# EAGLE design Puzzle Infrared Temperature Sensor V1.0 (EAGLE 6.2)
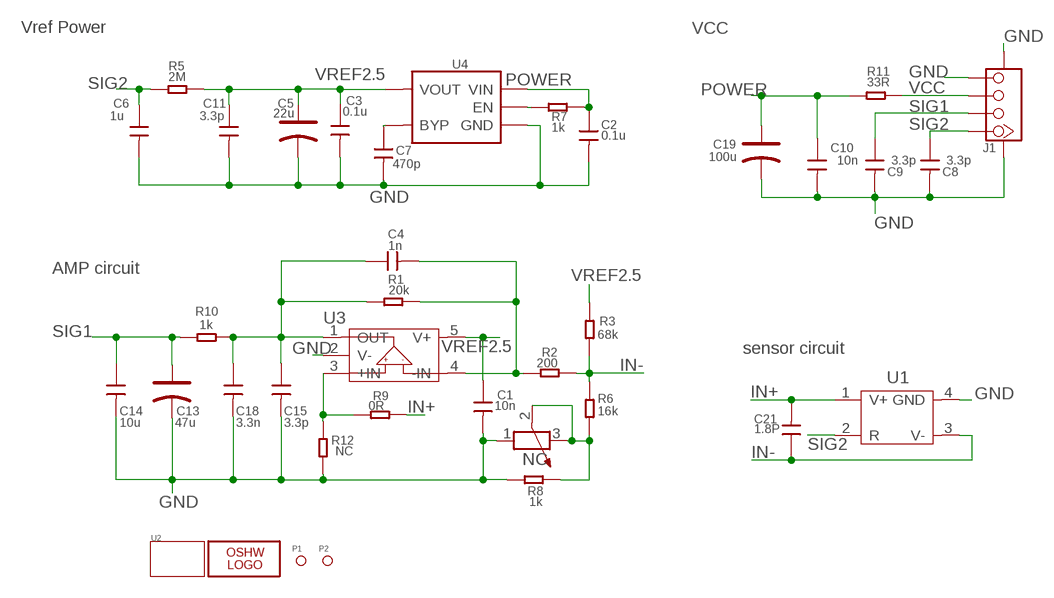
[diagram p0: schematic, sheet 1]

## Parts
C1  10n  C-0603  [0603]
C2  0.1u  C-0402  [0402]
C3  0.1u  C-0402  [0402]
C4  1n  C-0603  [0603]
C5  22u  CAP-AVX-A  [AVX-A]
C6  1u  C-0603  [0603]
C7  470p  C-0402  [0402]
C8  3.3p  C-0402  [0402]
C9  3.3p  C-0402  [0402]
C10  10n  C-0402  [0402]
C11  3.3p  C-0402  [0402]
C13  47u  CAP-AVX-A  [AVX-A]
C14  10u  C-0603  [0603]
C15  3.3p  C-0603  [0603]
C18  3.3n  C-0603  [0603]
C19  100u  CAP-AVX-B  [AVX-B]
C21  1.8P  C-0603  [0603]
J1  TWIG-4P-2.0-SMD-FEMALE-REINFORCE'90D'  [4P-SMD-2.0-90D]
LOGO1  LOGO-OSHW-6MILX0200-NT  [OSHW_6X200_NOTEXT]
P1  PAD-MARK  [ROUND-MARK-0.635]
P2  PAD-MARK  [ROUND-MARK-0.635]
R1  20k  R-0603  [0603]
R2  200  R-0603  [0603]
R3  68k  R-0603  [0603]
R4  NC  R-POTENTIOMETER-SMD  [3P-SMD-SQUA-3.6X3.3]
R5  2M  R-0402  [0402]
R6  16k  R-0603  [0603]
R7  1k  R-0402  [0402]
R8  1k  R-0603  [0603]
R9  0R  R-0603  [0603]
R10  1k  R-0603  [0603]
R11  33R  R-0402  [0402]
R12  NC  R-0603  [0603]
U1  SENSOR-OTP-538U  [4P-5.4MM]
U2  TWIG-2U  [2U-DIM-W/-DRILL]
U3  OPA333  [SOT23-5]
U4  MIC5205  [SOT23-5]

## Nets
GND: C1.2 C2.2 C3.2 C5.- C6.2 C7.2 C8.2 C9.2 C10.2 C11.2 C13.- C14.2 C15.2 C18.2 C19.- J1.4 J1.SS1 J1.SS2 R4.1 R8.1 R12.1 U1.4(GND) U3.2(V-) U4.2(GND)
IN+: C21.2 R9.1 U1.1(V+)
IN-: C21.1 R2.1 R3.2 R6.1 U1.3(V-)
N$1: C4.2 R1.1 R2.2 U3.4(-IN)
N$2: R4.2 R4.3 R6.2 R8.2
N$3: R7.1 U4.3(EN)
N$4: R9.2 R12.2 U3.3(+IN)
N$5: C7.1 U4.4(BYP)
N$10: C4.1 C15.1 C18.1 R1.2 R10.1 U3.1(OUT)
POWER: C2.1 C10.1 C19.+ R7.2 R11.1 U4.1(VIN)
SIG1: C9.1 C13.+ C14.1 J1.2 R10.2
SIG2: C6.1 C8.1 J1.1 R5.1 U1.2(R)
VCC: J1.3 R11.2
VREF2.5: C1.1 C3.1 C5.+ C11.1 R3.1 R5.2 U3.5(V+) U4.5(VOUT)

## Notes on the sheet
- Vref Power | VCC
- AMP circuit
- sensor circuit

## Library data of the parts
C1-C4 C6-C11 C14 C15 C18 C21 = Discrete:C*: Ceramic Capacitors
C5 C13 C19 = Discrete:CAP*: Electrolytic Capacitors,Tantalum Capacitors and Super Capacitors
J1 = Connector:TWIG-4P-2.0-SMD-FEMALE-REINFORCE
LOGO1 = Logo:LOGO-OSHW-6MIL
P1 P2 = Discrete:PAD-MARK
R1-R3 R5-R12 = Discrete:R*
R4 = Discrete:R-POTENTIOMETER*: Potentiometer
U1 = Discrete:SENSOR-OTP-538U
U2 = Module:TWIG
U3 = IC:OPA333
U4 = IC:MIC5205: The MIC5205 is an efficient linear voltage regulator with ultra-low-noise output, very low dropout voltage (typically 17mV at light loads and 165mV at 150mA), and very low ground current (600µA at 100mA output). The MIC5205 offers better than 1% initial accuracy. datasheet here: http://www.micrel.com/product-info/prod/5205.shtml

## Board
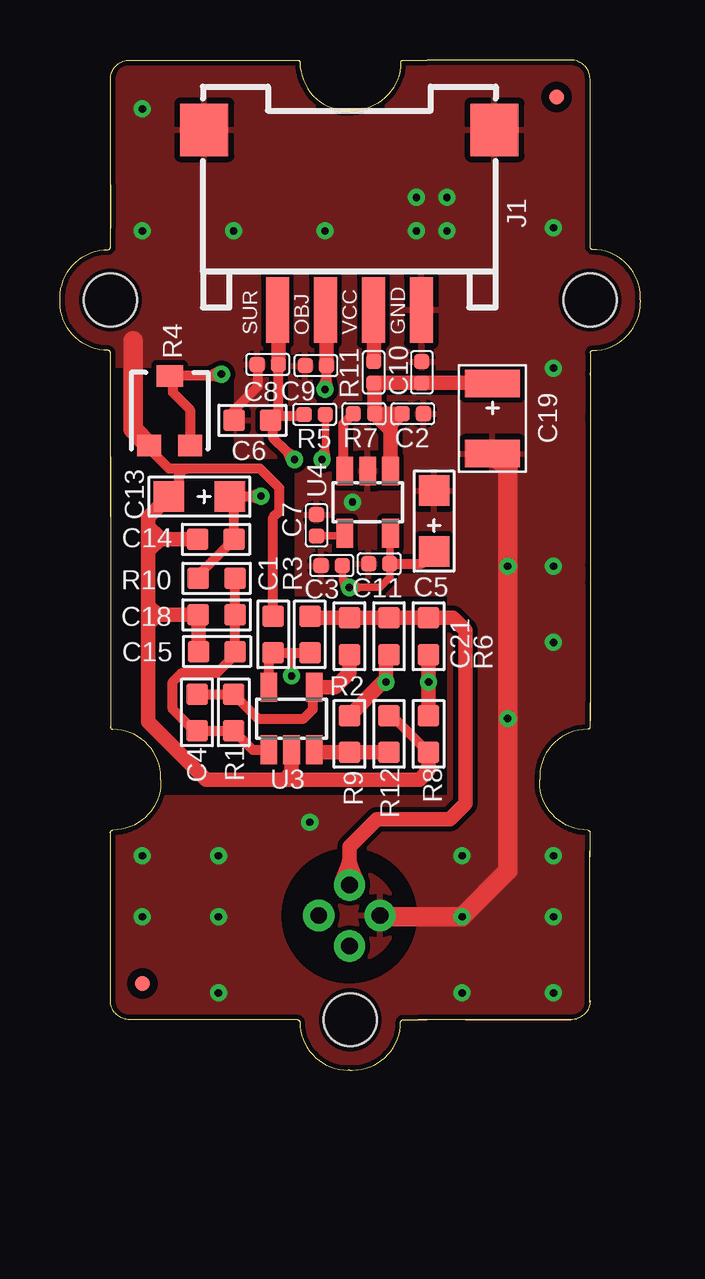
[diagram p1: board, top side]
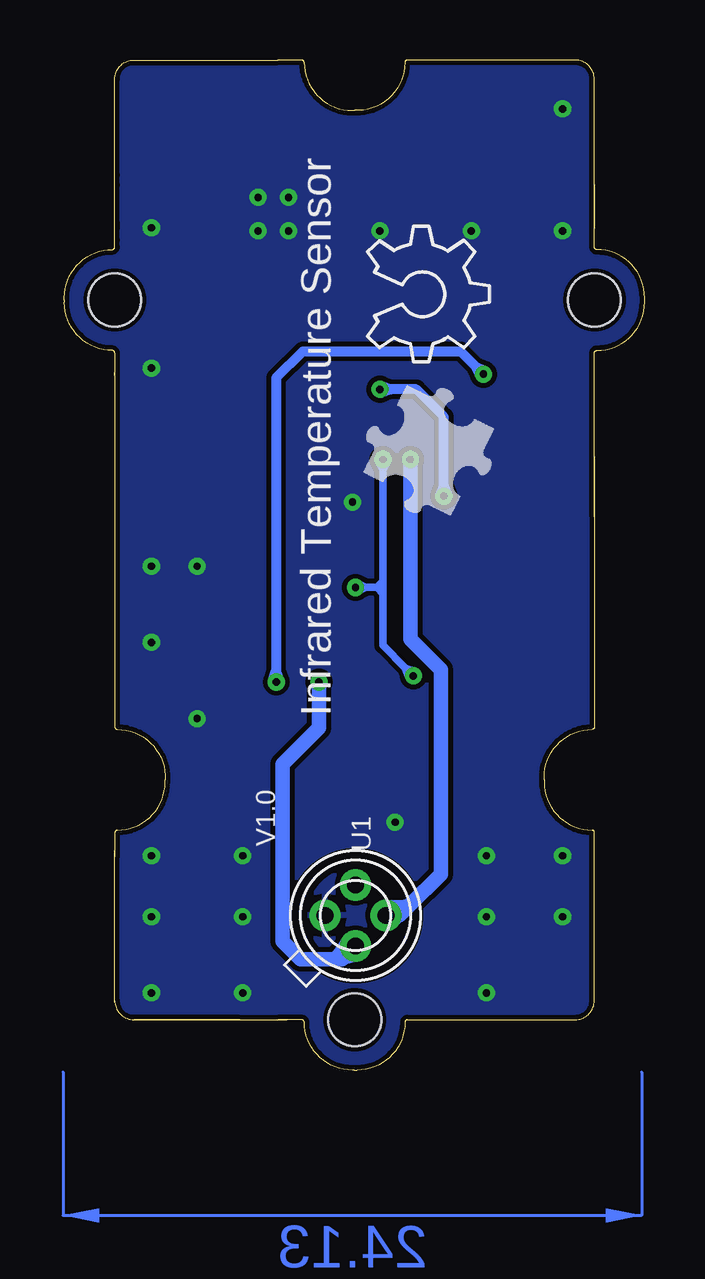
[diagram p2: board, bottom side, seen from below]

Size 24.2 x 42.09 mm. Coordinates in mm from the lower left corner, seen from the top.
Copper layers (1*16): Top 0.035mm / dielectric 1.5mm / Bottom 0.035mm
Design rules "default": minimum track width 6mil, minimum drill 12mil, track to track 8mil, track to pad 8mil, pad to pad 8mil, via to via 8mil, smd to smd 8mil, copper to edge 8mil, drill to drill 8mil, minimum pad ring 10mil, minimum via ring 8mil, stop-mask expansion 4mil, vias tented up to drill 25mil, thermal gap 10mil
tRestrict: area 9.6,4 to 14.5,8.8; area 2.2,11.5 to 16.1,19.7; area 2.2,19.7 to 9.8,25.4; area 2.2,25.4 to 7.2,29.3
bRestrict: area 9.6,4 to 14.5,8.8

### Footprints (pad centres in the part's own frame; a part is rotated, then mirrored left to right if it is on the bottom)
0603 = smd 0.889 x 0.889: 1 -0.762,0; 2 0.762,0
0402 = smd 0.635 x 0.635: 1 -0.445,0; 2 0.445,0
AVX-A = smd 1.27 x 1.27: + -1.27,0; - 1.27,0
AVX-B = smd 1.143 x 2.286: + -1.46,0; - 1.46,0
4P-SMD-2.0-90D = smd 0.965 x 2.74: 1 -3,-0.1; 2 -1,-0.1; 3 1,-0.1; 4 3,-0.1 | smd 2 x 2.184: SS1 -6.05,7.4; SS2 6.05,7.4
ROUND-MARK-0.635 = smd 0.635 x 0.635: P$1 0,0
3P-SMD-SQUA-3.6X3.3 = smd 1 x 0.9: 1 -0.85,-1.45; 3 0.85,-1.45 | smd 1.1 x 0.9: 2 0,1.45
4P-5.4MM = drill 0.7 pad 1.3: 1 0.9,-0.9; 2 0.9,0.9; 3 -0.9,0.9; 4 -0.9,-0.9
2U-DIM-W/-DRILL = hole 2.2: 10.453,-10.42; 10.453,9.58; -19.535,-0.415
SOT23-5 = smd 0.69 x 1.2: 1 -0.95,-1.3; 2 0,-1.3; 3 0.95,-1.3; 4 0.95,1.3; 5 -0.95,1.3

### Placement (x,y rotation side)
C1  8.89,18.16 90 top
C2  14.7,27.35 0 top
C3  11.32,21.03 180 top
C4  5.71,14.9 90 top
C5  15.59,22.88 90 top
C6  8.02,27.07 180 top
C7  10.69,22.7 90 top
C8  8.66,29.41 180 top
C9  10.66,29.36 180 top
C10  15.08,29.08 90 top
C11  13.31,21.1 180 top
C13  5.81,23.9 180 top
C14  6.5,22.12 180 top
C15  6.54,17.44 180 top
C18  6.52,18.97 180 top
C19  18.03,27.15 270 top
C21  13.71,18.08 270 top
J1  12.06,31.78 0 top
LOGO1  11.55,35.17 270 bottom
P1  3.43,3.6 90 top
P2  20.7,40.56 90 top
R1  7.24,14.9 270 top
R2  12.06,18.08 270 top
R3  10.41,18.16 90 top
R4  4.57,27.48 0 top
R5  10.61,27.32 0 top
R6  15.36,18.08 270 top
R7  12.67,27.35 0 top
R8  15.36,14.02 90 top
R9  12.06,14.02 270 top
R10  6.52,20.49 180 top
R11  13.08,29.08 90 top
R12  13.71,14.02 270 top
U1  12.06,6.45 315 bottom
U2  11.68,21.64 90 top
U3  9.65,14.65 0 top
U4  12.82,23.67 180 top
U$1  [BRICK-LOGO-2-B-MIL-0.6]  12.06,22.78 90 top

### Tracks (layer width: path | path; a pad name or v marks a point on that pad's centre or on a via)
GND  (via drill 0.3 pad 0.64)
  Top 0.305: 9.14,12.11 9.65,12.62
  Top 0.406: R12.1 13.84,14.78 R8.1 | C1.2 8.89,23.03 9.14,23.29 9.14,24.25 8.33,25.06 5.33,25.06 | 4.82,24.18 C13.- 4.95,24.3 4.95,24.68 | R4.1 3.72,25.89 4.54,25.06 4.95,25.06 | 5.33,25.06 4.95,25.06 | 4.95,25.06 4.95,24.68 | 5.33,25.06 arc90 4.95,24.68 | C6.2 7.26,27.5 8.25,28.49 8.25,29.37 C8.2
  Top 0.61: 9.65,12.36 9.65,12.24 9.78,12.11 | U3.2 9.65,12.62 9.65,12.36 | 3.68,22.27 3.68,23.03 C13.- | 3.68,22.27 3.68,19.35 | 3.68,19.35 3.68,19.09 | 3.68,19.09 3.68,18.59 | 3.68,18.59 3.68,14.52 6.09,12.11 9.14,12.11 9.78,12.11 | 3.91,22.12 C14.2 | 3.68,22.27 3.83,22.12 3.91,22.12 | 3.68,19.09 3.81,18.97 4.06,18.97 | 5.78,18.95 C15.2 | 9.78,12.11 9.9,12.11 | 9.9,12.11 14.98,12.11 15.36,12.49 R8.1 | 4.06,18.97 3.68,18.59 | 4.06,18.97 C18.2 | 3.68,19.35 4.06,18.97 | 4.06,22.27 4.12,22.21 4.12,22.08 3.74,21.7 | 4.06,22.27 3.74,22.59 | 3.91,22.12 4.06,22.27 | 9.65,12.36 9.9,12.11 | 4.82,24.18 4.57,24.18 4.44,24.05
  Top 0.813: C18.2 5.78,18.95 | C19.- 18.66,25.05 18.66,8.3 v16.76,6.4 13.38,6.4 U1.4 | 3.04,30.4 3.04,26.7 R4.1
  other vias: 12.19,23.67 20.57,17.82 18.66,14.65 20.57,29.25 20.57,35.1 3.43,34.97 7.24,34.97 14.86,34.97 11.04,34.97 3.43,40.05 18.66,21 20.57,21 3.43,6.4 3.43,8.94 6.6,8.94 6.6,6.4 6.6,3.22 20.57,3.22 20.57,6.4 20.57,8.94 16.76,8.94 16.76,3.22 16.12,34.97 16.12,36.37 14.86,36.37 10.41,10.33
  pour Top: 25.02,-0.59 -0.38,-0.59 -0.38,42.59 25.02,42.59
  pour Bottom: 24.25,-0.08 0.12,-0.08 0.12,42.08 24.25,42.08
IN+  (via drill 0.3 pad 0.64)
  Top 0.61: 12.06,14.9 R9.1 13.46,16.17 v13.59,16.17 13.59,17.19 C21.2
  Bottom 0.61: U1.1 12.62,4.62 12.74,4.62 | 12.95,4.62 14.35,4.62 15.11,5.38 15.11,12.75 13.59,14.27 v13.59,16.17 | 12.95,4.62 | 12.95,4.62 12.74,4.62 | 12.95,4.62 12,5.01 | U1.1 12,5.01 | 12.95,4.62 12.82,4.74 | 12.82,4.74 12.18,5.3 | U1.1 12.18,5.3 | 12.95,4.62 12.82,4.74 | 12.82,4.74 12.18,5.3 | U1.1 12.18,5.3 | 12.95,4.62 12,5.01 | 12,5.01 U1.1 | 12.74,4.62 12.37,5.33 U1.1 | 12.74,4.62 11.96,4.84 U1.1 | 12.82,4.74 12.34,5.38 | U1.1 12.34,5.38 | 12.82,4.74 12.02,4.83 | 12.82,4.74 12.34,5.38 | U1.1 12.34,5.38 | 12.02,4.83 12.82,4.74 | U1.1 12.02,4.83 | U1.1 12.35,5.36 12.79,4.69 12,4.83 U1.1
IN-
  Top 0.61: R3.2 10.49,18.84 R2.1 C21.1 R6.1 16.38,18.84 16.9,18.32 16.9,11.1 16.26,10.46 13.2,10.46 12.06,9.32 12.06,8.77 | 12.06,8.77 12.06,8.59 | 12.06,8.59 U1.3 | 12.09,8.59 12.23,7.75 | 12.23,7.75 U1.3 | 12.06,8.77 11.89,7.75 | 11.89,7.75 U1.3 | 12.06,8.77 11.89,7.75 | 11.89,7.75 U1.3 | 12.09,8.59 12.23,7.75 | 12.23,7.75 U1.3 | 12.06,8.77 11.89,7.75 | 12.06,8.77 12.09,8.59 | 12.09,8.59 12.23,7.75 | 12.03,8.59 12.06,8.77 | 11.89,7.75 12.03,8.59 | 11.89,7.75 U1.3 | 12.06,8.77 12.09,8.59 | 12.23,7.75 12.09,8.59 | 12.23,7.75 U1.3 | 12.06,8.59 11.74,7.86 U1.3 | 12.06,8.59 12.38,7.86 U1.3 | 11.74,7.84 | 12.03,8.59 11.74,7.84 | U1.3 11.74,7.84 | 12.03,8.59 12.37,7.87 | 12.37,7.87 | U1.3 12.37,7.87 | 12.09,8.59 11.75,7.87 | 12.09,8.59 12.38,7.84 | 11.74,7.84 12.03,8.59 | U1.3 11.74,7.84 | 12.37,7.87 12.03,8.59 | U1.3 12.37,7.87 | 11.75,7.87 12.09,8.59 | 11.75,7.87 U1.3 | 12.38,7.84 12.09,8.59 | 12.38,7.84 U1.3
N$1
  Top 0.406: C4.2 R1.1 8.25,14.65 10.16,14.65 10.54,15.03 10.54,15.89 U3.4
  Top 0.61: U3.4 11.46,15.95 12.06,16.55 R2.2
N$2  (via drill 0.3 pad 0.64)
  Top 0.406: 6.28,28.93 R4.2 4.7,28.8 4.7,28.24 5.42,27.52 R4.3 | 6.28,28.93 6.65,28.93 v6.73,29 | 6.28,28.93 6.7,28.85 v6.73,29 | 6.28,28.93 6.65,29.13 v6.73,29
  Top 0.61: R8.2 v15.36,16.17 R6.2
  Bottom 0.406: 15.36,16.63 v15.36,16.17 | 7.05,29.32 v6.73,29 | 7.05,29.32 7.68,29.95 14.26,29.95 15.36,28.84 15.36,16.63 | 15.36,16.63 | 15.36,16.63 15.22,16.23 | 15.36,16.63 15.51,16.23 | 15.51,16.23 | v15.36,16.17 15.51,16.23 | 15.22,16.23 15.36,16.63 | 15.22,16.23 | 15.22,16.23 | 15.36,16.63 15.22,16.23 | 15.22,16.23 v15.36,16.17 | 15.36,16.63 15.51,16.23 | 15.51,16.23 | 15.36,16.63 15.22,16.23 | v15.36,16.17 15.22,16.23 | 15.36,16.63 | 15.51,16.23 15.36,16.63 | 15.51,16.23 v15.36,16.17 | 15.36,16.63 15.22,16.23 | v15.36,16.17 15.22,16.23 | 15.51,16.23 15.36,16.63 | 15.51,16.23 v15.36,16.17 | 7.05,29.32 6.66,29.14 v6.73,29 | 7.05,29.32 6.87,28.93 v6.73,29
N$3
  Top 0.406: U4.3 11.81,25.03 11.81,26.93 R7.1
N$4
  Top 0.61: U3.3 10.6,13.25 R9.2 R12.2
N$5
  Top 0.305: C7.1 11.76,22.26 U4.4
N$10
  Top 0.406: R10.1 C18.1 7.3,18.95 C15.1 7.36,17.38 6.54,16.55 5.08,16.55 4.7,16.17 4.7,15.03 5.58,14.14 C4.1 R1.2 8.03,13.35 U3.1
POWER
  Top 0.61: C10.1 15.07,28.62 | R7.2 13.12,28.59 R11.1 C10.1 | U4.1 | 13.77,26.69 U4.1 | R7.2 13.77,26.69 | 14.22,27.35 C2.1 | R7.2 14.22,27.35 | 13.77,26.69 13.77,26.9 14.22,27.35 | C10.1 18.01,28.63 C19.+
SIG1  (via drill 0.3 pad 0.64)
  Top 0.406: 11.11,28.82 11.11,28.43 v11.04,28.37 | 11.11,28.82 C9.1 | R10.2 5.76,20.62 C14.1 7.26,23.72 C13.+ 7.11,23.92 7.92,23.92 | 7.92,23.92 v8.38,23.92 | 7.92,23.92 | 7.92,23.92 8.33,23.78 | 7.92,23.92 8.33,24.07 | 8.33,24.07 | v8.38,23.92 8.33,24.07 | 8.33,23.78 | 11.11,28.82 10.91,28.44 v11.04,28.37 | 11.11,28.82 11.19,28.4 v11.04,28.37 | 8.33,23.78 7.92,23.92 | 8.33,23.78 | 7.92,23.92 8.33,23.78 | 8.33,23.78 v8.38,23.92 | 7.92,23.92 8.33,24.07 | 8.33,24.07 | 7.92,23.92 8.33,23.78 | v8.38,23.92 8.33,23.78 | 7.92,23.92 | 8.33,24.07 7.92,23.92 | 8.33,24.07 v8.38,23.92 | 7.92,23.92 8.33,23.78 | v8.38,23.92 8.33,23.78 | 8.33,24.07 7.92,23.92 | 8.33,24.07 v8.38,23.92
  Top 0.61: C9.1 11.11,31.68 J1.2
  Bottom 0.406: v8.38,23.92 8.38,24.38 | 10.59,28.37 v11.04,28.37 | 10.59,28.37 9.52,28.37 8.38,27.22 8.38,24.38 | 10.59,28.37 | 10.59,28.37 10.99,28.22 | 10.59,28.37 10.99,28.51 | 10.99,28.51 | v11.04,28.37 10.99,28.51 | 10.99,28.22 | 8.38,24.38 | 8.38,24.38 8.23,23.97 | 8.23,23.97 | v8.38,23.92 8.23,23.97 | 8.38,24.38 8.52,23.97 | 10.99,28.22 10.59,28.37 | 10.99,28.22 | 10.59,28.37 10.99,28.22 | 10.99,28.22 v11.04,28.37 | 10.59,28.37 10.99,28.51 | 10.99,28.51 | 10.59,28.37 10.99,28.22 | v11.04,28.37 10.99,28.22 | 10.59,28.37 | 10.99,28.51 10.59,28.37 | 10.99,28.51 v11.04,28.37 | 10.59,28.37 10.99,28.22 | v11.04,28.37 10.99,28.22 | 10.99,28.51 10.59,28.37 | 10.99,28.51 v11.04,28.37 | 8.38,24.38 | 8.23,23.97 8.38,24.38 | 8.23,23.97 8.38,24.38 | 8.23,23.97 | 8.52,23.97 8.38,24.38 | 8.52,23.97 | v8.38,23.92 8.52,23.97 | 8.23,23.97 8.38,24.38 | v8.38,23.92 8.23,23.97 | 8.52,23.97 8.38,24.38 | 8.52,23.97 | v8.38,23.92 8.52,23.97 | 8.23,23.97 8.38,24.38 | v8.38,23.92 8.23,23.97 | 8.52,23.97 8.38,24.38 | v8.38,23.92 8.52,23.97
SIG2  (via drill 0.3 pad 0.64)
  Top 0.406: v9.78,25.45 9.45,25.77 | 9.45,25.77 8.89,26.33 8.89,26.97 C6.1 | C6.1 8.86,27.07 9.06,27.27 10.12,27.27 R5.1 | C8.1 9.1,27.39 C6.1 | 9.45,25.77 9.64,25.38 v9.78,25.45 | 9.45,25.77 9.84,25.58 v9.78,25.45
  Top 0.61: C8.1 9.1,31.68 J1.1
  Bottom 0.61: v9.78,25.45 9.78,17.95 8.51,16.68 8.51,8.17 9.82,6.86 | 9.82,6.86 9.96,6.72 | 9.96,6.72 10.23,6.45 U1.2 | 9.82,6.86 10.7,6.3 U1.2 | 9.82,6.86 10,6.82 | 10,6.82 10.83,6.61 U1.2 | 9.96,6.72 10.56,6.19 U1.2 | 9.96,6.72 10.76,6.79 U1.2 | U1.2 10.55,6.2 9.97,6.76 10.78,6.79 U1.2 | 10,6.82 10.53,6.22 U1.2 | 10,6.82 10.8,6.79 U1.2
VCC
  Top 0.61: R11.2 13.08,31.68 J1.3
VREF2.5  (via drill 0.3 pad 0.64)
  Top 0.305: U4.5 13.75,22.34 C11.1 13.75,20.53 13.33,20.11 12.52,20.11 | v12.06,20.11 12.52,20.11 | 11.77,20.46 11.77,20.4 v12.06,20.11 | 11.77,20.46 C3.1 | 11.06,25.88 11.06,25.59 v10.92,25.45 | 11.06,25.88 R5.2 | 9.52,17.39 9.65,17.27 9.65,17.19 | 9.65,17.19 9.52,17.32 | 9.65,16.89 v9.65,16.43 | 9.65,17.19 9.65,16.89 | 9.65,17.19 9.9,17.44 | 12.52,20.11 | 12.52,20.11 12.15,20.29 | 12.52,20.11 12.15,19.93 | 12.15,19.93 | v12.06,20.11 12.15,19.93 | 12.15,20.29 | 9.65,16.89 | 9.65,16.89 9.47,16.52 | 9.47,16.52 | v9.65,16.43 9.47,16.52 | 9.65,16.89 9.83,16.52 | 11.06,25.88 10.77,25.59 v10.92,25.45 | 11.06,25.88 11.12,25.48 v10.92,25.45 | 12.15,20.29 | 12.52,20.11 | 12.15,20.29 12.52,20.11 | v12.06,20.11 12.15,20.29 | 12.15,19.93 12.52,20.11 | 12.15,19.93 | 12.15,20.29 12.52,20.11 | v12.06,20.11 12.15,20.29 | 12.52,20.11 | 12.15,19.93 12.52,20.11 | v12.06,20.11 12.15,19.93 | 12.15,20.29 12.52,20.11 | v12.06,20.11 12.15,20.29 | 12.15,19.93 12.52,20.11 | v12.06,20.11 12.15,19.93 | 11.77,20.46 11.86,20.06 v12.06,20.11 | 11.77,20.46 12.14,20.3 v12.06,20.11 | 9.65,16.89 9.47,16.52 | 9.65,16.89 | 9.65,16.89 | 9.47,16.52 9.65,16.89 | 9.47,16.52 | 9.65,16.89 9.83,16.52 | 9.83,16.52 | v9.65,16.43 9.83,16.52 | 9.47,16.52 9.65,16.89 | 9.47,16.52 v9.65,16.43 | 9.83,16.52 9.65,16.89 | 9.83,16.52 | 9.83,16.52 v9.65,16.43 | 9.65,16.89 9.47,16.52 | 9.47,16.52 v9.65,16.43 | 9.65,16.89 9.83,16.52 | 9.83,16.52 v9.65,16.43
  Top 0.406: U3.5 8.7,17.21 C1.1 9.52,17.39 R3.1 | C11.1 15.08,21.1 C5.+
  Bottom 0.305: 10.92,19.86 10.92,17.7 9.97,16.75 | 10.92,19.86 10.92,20.37 | 10.92,24.99 v10.92,25.45 | v9.65,16.43 9.97,16.75 | 11.6,20.11 v12.06,20.11 | 11.17,20.11 11.6,20.11 | 10.92,20.37 11.17,20.11 | 10.92,19.86 11.17,20.11 | 10.92,20.37 10.92,24.99 | 10.92,24.99 | 10.92,24.99 11.1,25.36 | 10.92,24.99 10.74,25.36 | 10.74,25.36 | v10.92,25.45 10.74,25.36 | 11.1,25.36 | 11.6,20.11 | 11.6,20.11 11.97,19.93 | 11.97,19.93 | v12.06,20.11 11.97,19.93 | 11.6,20.11 11.97,20.29 | 11.1,25.36 | 10.92,24.99 | 10.92,24.99 11.1,25.36 | v10.92,25.45 11.1,25.36 | 10.92,24.99 10.74,25.36 | 10.74,25.36 | 10.92,24.99 11.1,25.36 | v10.92,25.45 11.1,25.36 | 10.92,24.99 | 10.92,24.99 10.74,25.36 | 10.74,25.36 v10.92,25.45 | 10.92,24.99 11.1,25.36 | v10.92,25.45 11.1,25.36 | 10.92,24.99 10.74,25.36 | 10.74,25.36 v10.92,25.45 | 11.6,20.11 11.97,19.93 | 11.6,20.11 | 11.6,20.11 | 11.97,19.93 11.6,20.11 | 11.97,19.93 | 11.6,20.11 11.97,20.29 | 11.97,20.29 | v12.06,20.11 11.97,20.29 | 11.97,19.93 11.6,20.11 | 11.97,19.93 v12.06,20.11 | 11.97,20.29 11.6,20.11 | 11.97,20.29 | 11.97,20.29 v12.06,20.11 | 11.6,20.11 11.97,19.93 | 11.97,19.93 v12.06,20.11 | 11.6,20.11 11.97,20.29 | 11.97,20.29 v12.06,20.11 | 9.97,16.75 9.58,16.62 v9.65,16.43 | 9.97,16.75 9.84,16.36 v9.65,16.43
(copper drawn outside any net)
  shapes: Bottom area x1

### Text on the board
tPlace: SUR | OBJ | VCC | GND
bPlace: Infrared Temperature Sensor | V1.0